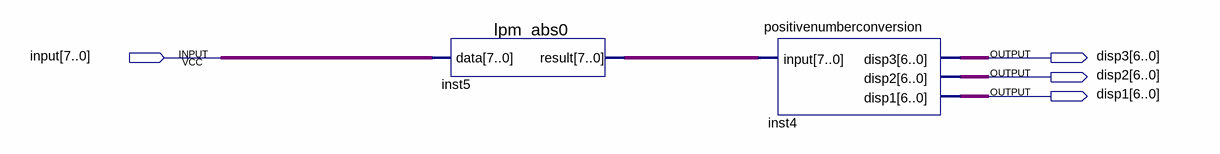
[diagram p0: schematic sheet]
// Quartus schematic negativenumberconversion.bdf as structural Verilog: 2 symbols, 4 pins
module negativenumberconversion (
  input  [7:0] \input ,
  output [6:0] disp3,
  output [6:0] disp2,
  output [6:0] disp1
);

  wire [7:0] inst5_result;

  lpm_abs0 inst5 (.data(\input ), .result(inst5_result));
  positivenumberconversion inst4 (.\input (inst5_result), .disp3(disp3), .disp2(disp2), .disp1(disp1));
endmodule
